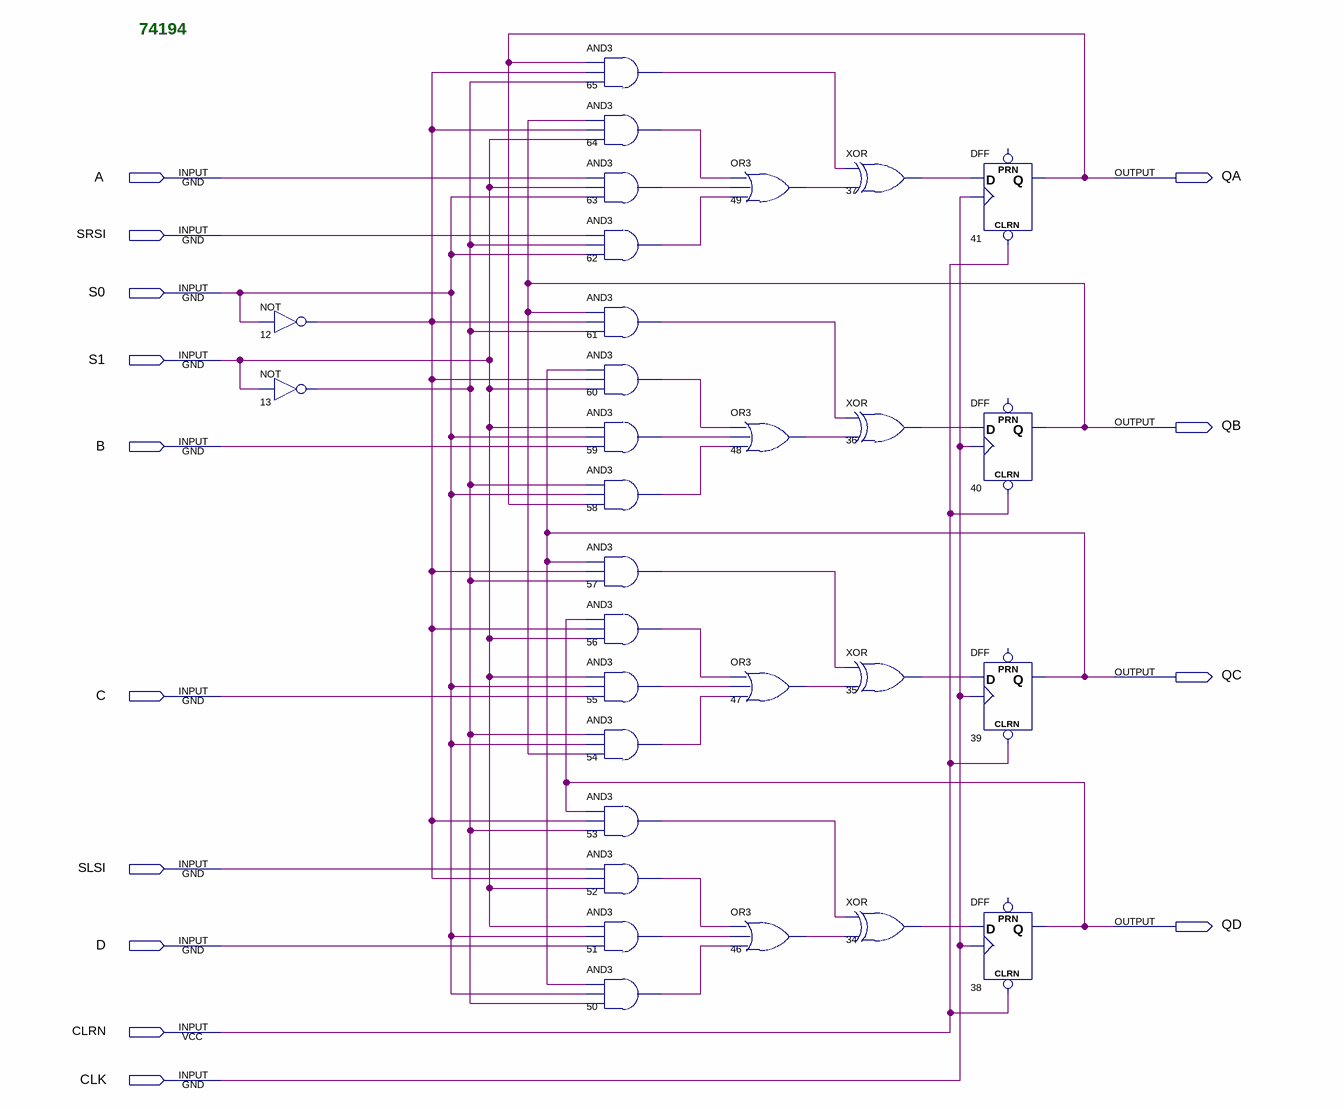
[diagram p0: schematic sheet]
// Quartus schematic 74194.bdf as structural Verilog: 30 symbols, 14 pins
module \74194  (
  input  A,
  input  SRSI,
  input  S0,
  input  S1,
  input  B,
  input  C,
  input  SLSI,
  input  D,
  input  CLRN,
  input  CLK,
  output QA,
  output QB,
  output QC,
  output QD
);

  wire n12_out, n13_out, n34_out, n35_out, n36_out, n37_out, n46_out, n47_out, n48_out, n49_out, n50_out,
       n51_out, n52_out, n53_out, n54_out, n55_out, n56_out, n57_out, n58_out, n59_out, n60_out, n61_out,
       n62_out, n63_out, n64_out, n65_out;

  not u_12 (n12_out, S0);
  not u_13 (n13_out, S1);
  and u_65 (n65_out, QA, n12_out, n13_out);
  and u_64 (n64_out, QB, n12_out, S1);
  and u_63 (n63_out, A, S1, S0);
  and u_62 (n62_out, SRSI, n13_out, S0);
  and u_61 (n61_out, QB, n12_out, n13_out);
  and u_60 (n60_out, QC, n12_out, S1);
  and u_59 (n59_out, S1, S0, B);
  and u_58 (n58_out, n13_out, S0, QA);
  and u_57 (n57_out, QC, n12_out, n13_out);
  and u_56 (n56_out, QD, n12_out, S1);
  and u_55 (n55_out, S1, S0, C);
  and u_54 (n54_out, n13_out, S0, QB);
  and u_53 (n53_out, QD, n12_out, n13_out);
  and u_52 (n52_out, SLSI, n12_out, S1);
  and u_51 (n51_out, S1, S0, D);
  and u_50 (n50_out, QC, S0, n13_out);
  or u_49 (n49_out, n64_out, n63_out, n62_out);
  or u_48 (n48_out, n60_out, n59_out, n58_out);
  or u_47 (n47_out, n56_out, n55_out, n54_out);
  or u_46 (n46_out, n52_out, n51_out, n50_out);
  xor u_37 (n37_out, n65_out, n49_out);
  xor u_36 (n36_out, n61_out, n48_out);
  xor u_35 (n35_out, n57_out, n47_out);
  xor u_34 (n34_out, n53_out, n46_out);
  DFF u_41 (.CLRN(CLRN), .CLK(CLK), .D(n37_out), .Q(QA));  // open: PRN
  DFF u_40 (.CLRN(CLRN), .CLK(CLK), .D(n36_out), .Q(QB));  // open: PRN
  DFF u_39 (.CLRN(CLRN), .CLK(CLK), .D(n35_out), .Q(QC));  // open: PRN
  DFF u_38 (.CLRN(CLRN), .CLK(CLK), .D(n34_out), .Q(QD));  // open: PRN

  // Notes on the sheet:
  //   74194
endmodule
